# EasyEDA Pro project ProProject_STM32F407IGT6_2024-02-27.epro, board PCB1
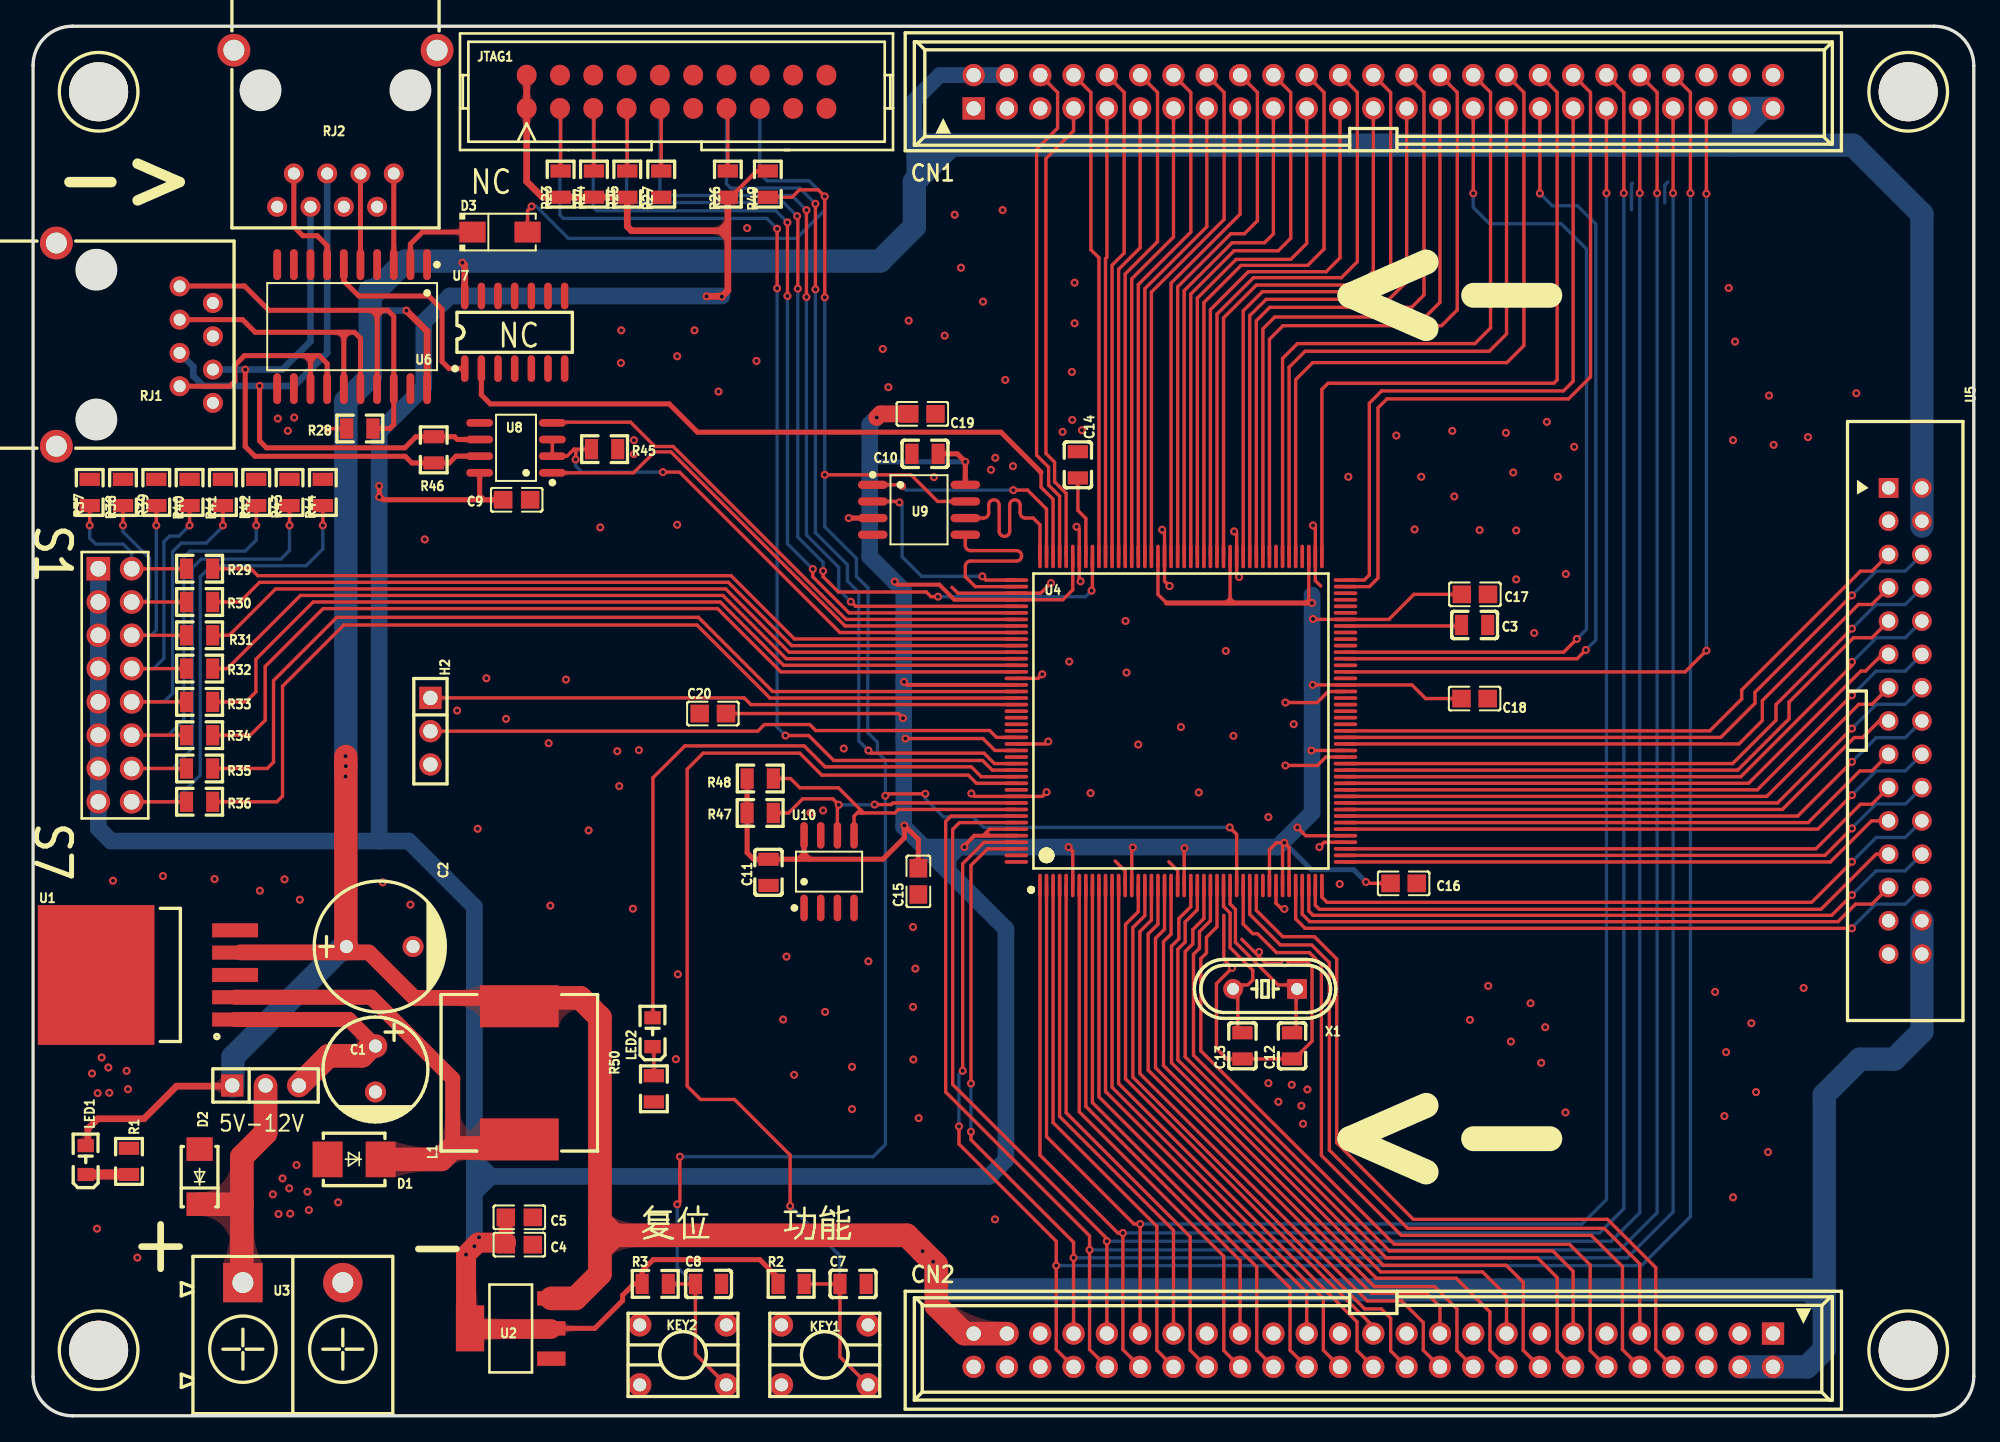
[diagram p10: board, top side]
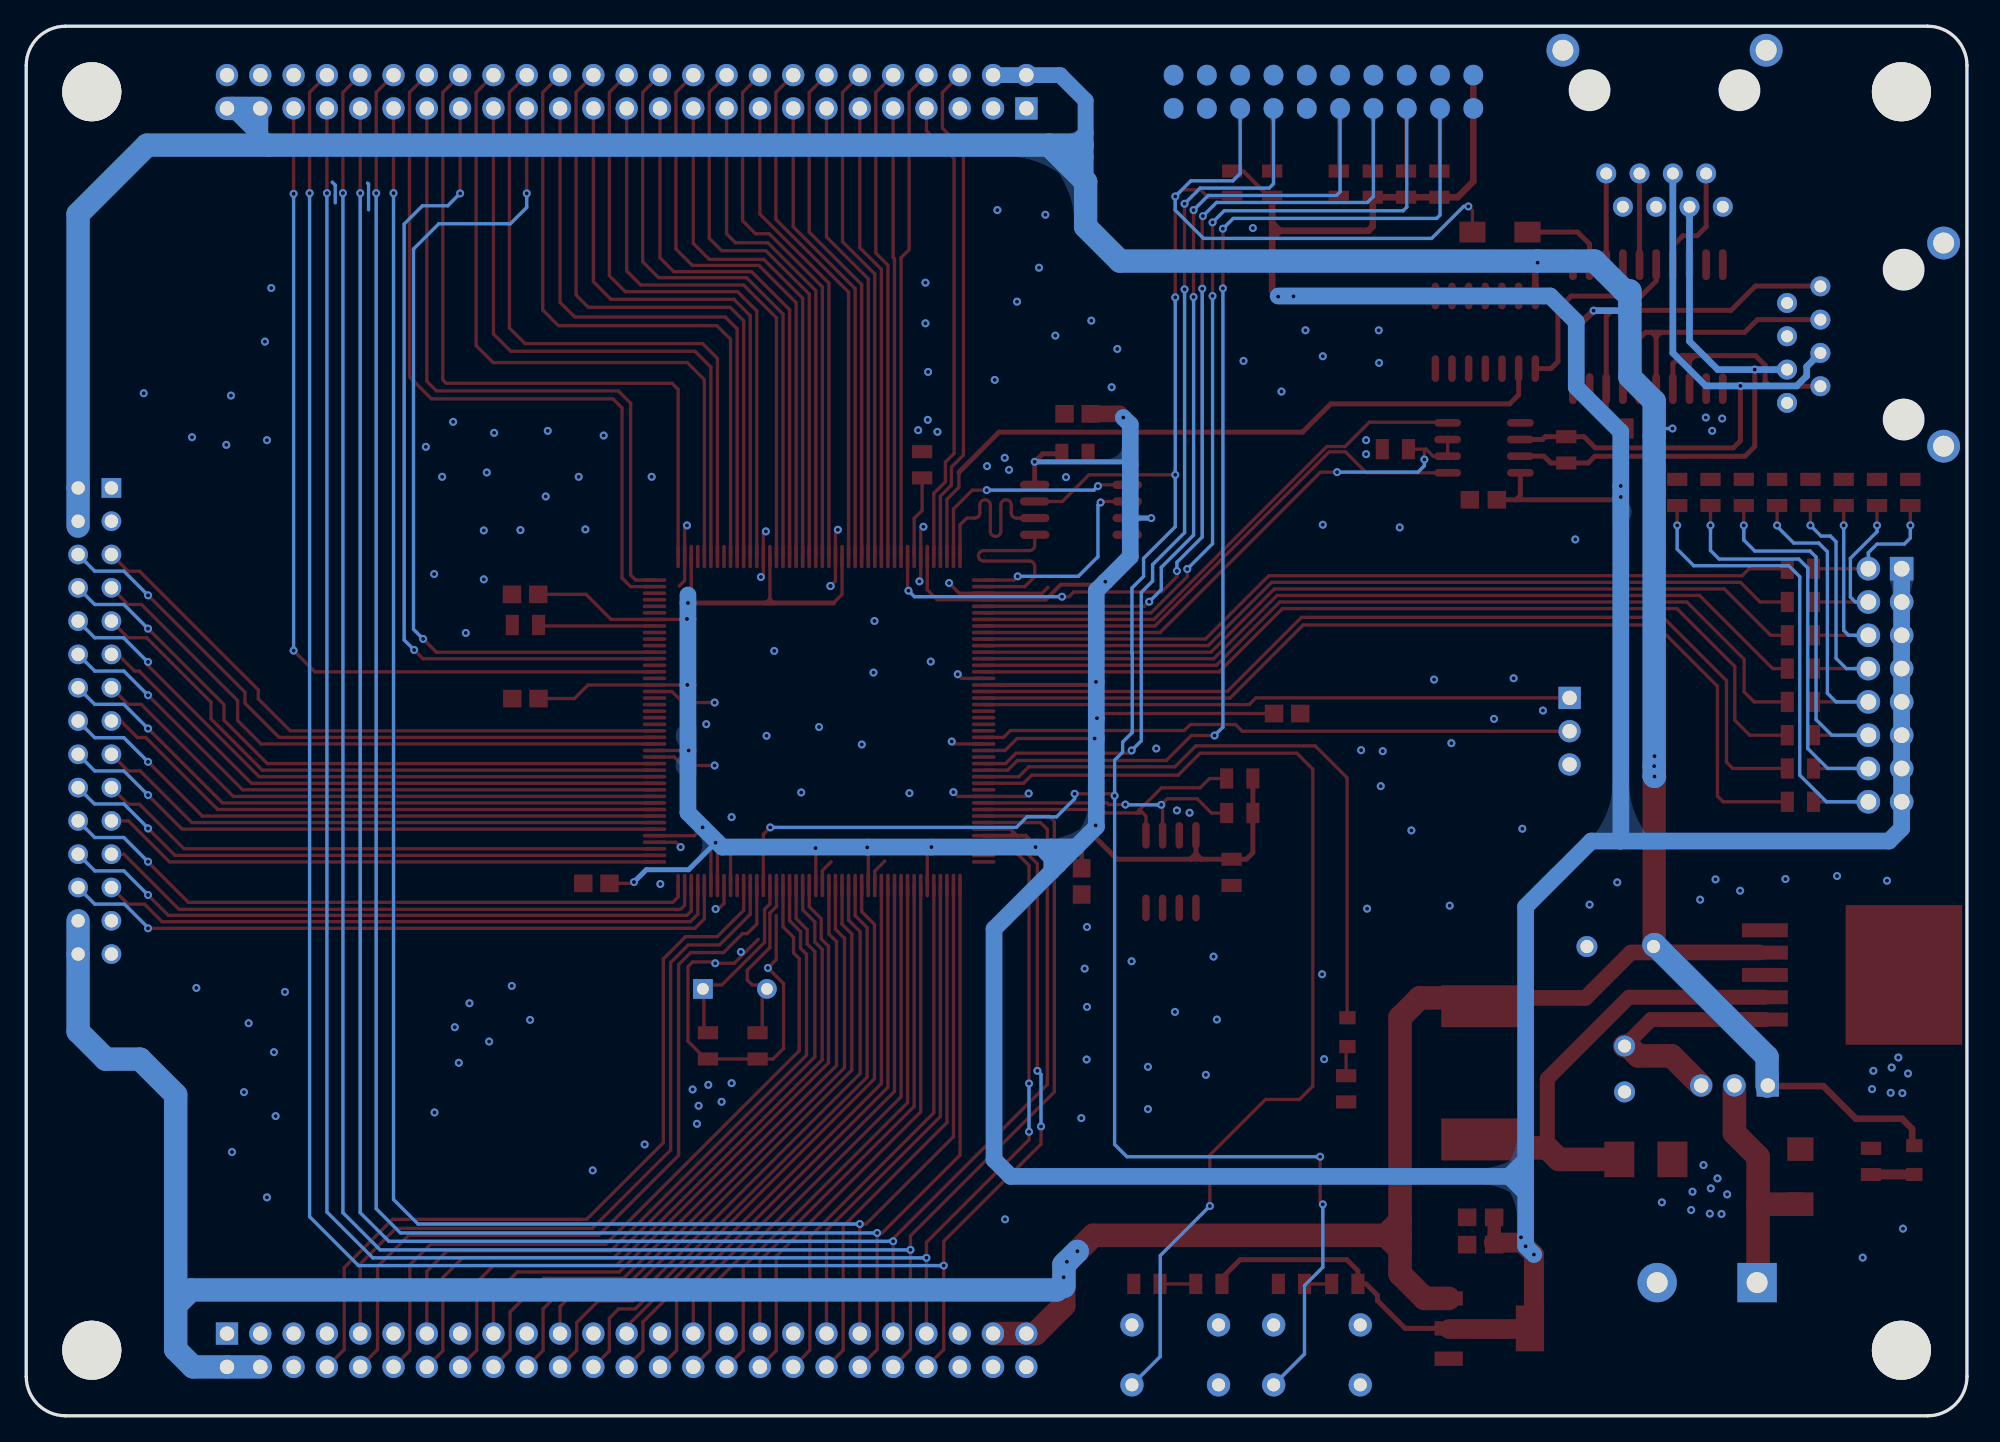
[diagram p11: board, bottom side, seen from below]

Outline 148 x 106 mm; copper layers: Top Layer, Bottom Layer. Coordinates in mm from the lower left corner of the outline.
Outline path: 0,103 0,3 arc(0.88,0.88) 3,0 145,0 arc(147.12,0.88) 148,3 148,103 arc(147.12,105.12) 145,106 3,106 arc(0.88,105.12) 0,103
Stack: Top Layer 0.035mm / Dielectric1 1.51mm FR4 er 4.5 / Bottom Layer 0.035mm

## Design rules (mm)
template: 自定义配置
spacing copperThickness1oz (default): track to track 0.102, other pairs 0.152 to 0.3
spacing copperThickness2oz: track to track 0.203, other pairs 0.152 to 0.3
track width copperThickness1oz (default): min 0.127, default 0.254, max 2.54
track width copperThickness2oz: min 0.203, default 0.254, max 2.54
differential pair differentialPair (default): width min 0.127, default 0.254, max 2.54; gap min 0.152, default 0.152
via viaSize (default): diameter min 0.5, default 0.61, max 10; hole min 0.3, default 0.305, max 6.299
net +12V uses 电源
net +5V uses 电源
net $1N10347 uses 电源
net +3.3V uses 电源

## Placement (name value [footprint] x y rotation side)
5V-12V  -  [HDR-TH_3P-P2.54-V-M]  17.73 25.2 0 top
C1  330uF  [直插电容C1]  26.11 26.42 0 top
C2  1000uF  [直插电容2]  27.64 38 270 top
C3  225  [C0805#2]  109.93 60.32 180 top
C4  106  [C0805#3]  37.08 13.06 180 top
C5  104  [C0805#3]  37.08 15.14 180 top
C7  104  [C0805#2]  62.53 10.06 0 top
C8  104  [C0805#2]  51.51 10.06 0 top
C9  104  [C0805#3]  36.88 69.88 0 top
C10  104  [C0805#2]  68.02 73.38 0 top
C11  104  [C0805#2]  56.08 41.45 90 top
C12  22pF  [C0805#2]  96.01 28.22 90 top
C13  22pF  [C0805#2]  92.23 28.22 90 top
C14  225  [C0805#2]  79.68 72.54 270 top
C15  100nF  [C0805]  67.51 40.77 90 top
C16  100nF  [C0805]  104.52 40.61 180 top
C17  100nF  [C0805]  109.96 62.66 180 top
C18  100nF  [C0805]  109.93 54.71 180 top
C19  100nF  [C0805]  67.82 76.43 180 top
C20  100nF  [C0805]  51.84 53.57 0 top
CN1  BH-00012  [IDC-TH_BH-00012]  102.21 101 0 top
CN2  BH-00012  [IDC-TH_BH-00012]  102.21 5 180 top
D1  SS34-B  [SMB_L4.6-W3.6-LS5.3-RD]  24.49 19.56 180 top
D2  SMAJ25A_C466027  [SMA_L4.4-W2.8-LS5.4-RD]  12.7 18.24 90 top
D3  1N4007  [SMA_L4.3-W2.5-LS5.0-RD]  35.61 90.3 0 top
H1  PZ254V-12-16P  [HDR-TH_16P-P2.54-V-M-R2-C8-S2.54]  6.25 55.73 270 top
H2  -  [HDR-TH_3P-P2.54-V-M]  30.3 52.22 270 top
JTAG1  JTAG  [JTAG_20]  49.07 101 0 top
KEY1  RESET  [按键]  55.42 1.72 0 top
KEY2  RESET  [按键]  44.61 1.72 0 top
L1  100uH  [IND-SMD_L12.0-W12.0_SLH1207S]  37.08 26.16 90 top
LED1  -  [LED0805-RD_RED]  4.01 19.51 90 top
LED2  -  [LED0805-RD_RED]  47.24 29.26 90 top
NOREF  -  [Pad_ie3261]  5 101 180 top
NOREF#2  -  [Pad_ie3266]  143 101 180 top
NOREF#3  -  [Pad_ie3269]  143 5 180 top
NOREF#4  -  [Pad_ie3140]  5 5 180 top
R1  1K  [R0805]  7.32 19.41 90 top
R2  10K  [R0805]  57.81 10.06 0 top
R3  10K  [R0805]  47.45 10.06 0 top
R23  10K  [R0805]  40.23 93.95 270 top
R24  10K  [R0805]  42.77 93.95 270 top
R25  10K  [R0805]  45.31 93.95 270 top
R26  10K  [R0805]  52.98 93.95 270 top
R27  10K  [R0805]  47.9 93.95 270 top
R28  10K  [R0805]  24.92 75.31 0 top
R29  10K  [R0805]  12.7 64.62 0 top
R30  10K  [R0805]  12.7 62.08 0 top
R31  10K  [R0805]  12.7 59.54 0 top
R32  10K  [R0805]  12.7 57 0 top
R33  10K  [R0805]  12.7 54.46 0 top
R34  10K  [R0805]  12.7 51.92 0 top
R35  10K  [R0805]  12.7 49.38 0 top
R36  10K  [R0805]  12.7 46.84 0 top
R37  10K  [R0805]  4.32 70.43 90 top
R38  10K  [R0805]  6.86 70.43 90 top
R39  10K  [R0805]  9.4 70.43 90 top
R40  10K  [R0805]  11.94 70.43 90 top
R41  10K  [R0805]  14.48 70.43 90 top
R42  10K  [R0805]  17.02 70.43 90 top
R43  10K  [R0805]  19.56 70.43 90 top
R44  10K  [R0805]  22.1 70.43 90 top
R45  10K  [R0805]  43.59 73.74 180 top
R46  120  [R0805]  30.56 73.69 270 top
R47  10K  [R0805]  55.45 45.98 180 top
R48  10K  [R0805]  55.46 48.61 180 top
R49  10K  [R0805]  56.03 93.95 270 top
R50  1K  [R0805]  47.35 24.94 270 top
RJ1  R-RJ45R10P-B000  [RJ45-TH_R-RJ45R10P-B000]  7.75 81.71 90 top
RJ2  R-RJ45R10P-B000  [RJ45-TH_R-RJ45R10P-B000]  23.06 98.2 0 top
U1  LM2596S-5.0  [TO-263-5_L10.6-W9.6-P1.70-LS15.9-BR]  10.11 33.63 0 top
U2  AMS1117-3.3_C165482  [SOT-223_L6.5-W3.5-P2.30-LS7.0-BR]  36.42 6.66 0 top
U3  KF7.62-2P  [CONN-TH_2P-P7.62_KEFA_KF7.62-2P]  19.81 10.16 0 top
U4  STM32F407IET6  [LQFP-176_L24.0-W24.0-P0.50-LS26.0-BL]  87.54 53 0 top
U5  ZX-IDC2.54-2-15PZZ  [IDC-TH_30P-P2.54_ZX-IDC2.54-2-15PZZ]  142.77 53 270 top
U6  74HC245D,653  [SOIC-20_L13.0-W7.6-P1.27-LS10.3-BL]  24.33 83.08 180 top
U7  74HC32D  [SOIC-14_L8.6-W3.8-P1.27-LS6.0-BL]  36.73 82.65 0 top
U8  MAX3485EESA+T  [SOIC-8_L4.9-W3.9-P1.27-LS6.0-BL]  36.83 73.84 90 top
U9  W25Q16JVSSIQ  [SOIC-8_L5.3-W5.3-P1.27-LS8.0-BL]  67.56 69.11 270 top
U10  AT24C02  [SOP-8_L5.0-W4.0-P1.27-LS6.0-BL]  60.7 41.51 0 top
X1  -  [HC-49US_L11.5-W4.5-P4.88]  93.95 32.56 180 top

## Footprints (pads in the part's own frame, mm; a bottom-side part is the same pattern mirrored in y, then rotated)
C0805
  rect 1.41x1.35 smd: 1(-1,0) 2(1,0)
C0805#2
  rect 1x1.55 smd: 1(-1,0) 2(1,0)
C0805#3
  rect 1.41x1.35 smd: 1(-1.03,0) 2(1.03,0)
CONN-TH_2P-P7.62_KEFA_KF7.62-2P
  rect 3x3 hole 1.6: 1(-3.81,0)
  round 3 hole 1.6: 2(3.81,0)
HC-49US_L11.5-W4.5-P4.88
  rect 1.501x1.501 hole 0.899: 1(-2.441,0)
  round 1.501 hole 0.899: 2(2.441,0)
HDR-TH_3P-P2.54-V-M
  rect 1.7x1.7 hole 1.1: 1(-2.54,0)
  round 1.7 hole 1.1: 2(0,0) 3(2.54,0)
HDR-TH_16P-P2.54-V-M-R2-C8-S2.54
  rect 1.8x1.8 hole 1.2: 1(-8.89,-1.27)
  round 1.8 hole 1.2: 2(-8.89,1.27) 3(-6.35,-1.27) 4(-6.35,1.27) 5(-3.81,-1.27) 6(-3.81,1.27) 7(-1.27,-1.27) 8(-1.27,1.27) 9(1.27,-1.27) 10(1.27,1.27) 11(3.81,-1.27) 12(3.81,1.27) 13(6.35,-1.27) 14(6.35,1.27) 15(8.89,-1.27) 16(8.89,1.27)
IDC-TH_30P-P2.54_ZX-IDC2.54-2-15PZZ
  rect 1.5x1.5 hole 1.02: 1(-17.78,-1.27)
  round 1.5 hole 1.02: 2(-17.78,1.27) 3(-15.24,-1.27) 4(-15.24,1.27) 5(-12.7,-1.27) 6(-12.7,1.27) 7(-10.16,-1.27) 8(-10.16,1.27) 9(-7.62,-1.27) 10(-7.62,1.27) 11(-5.08,-1.27) 12(-5.08,1.27) 13(-2.54,-1.27) 14(-2.54,1.27) 15(0,-1.27) 16(0,1.27) 17(2.54,-1.27) 18(2.54,1.27) 19(5.08,-1.27) 20(5.08,1.27) 21(7.62,-1.27) 22(7.62,1.27) 23(10.16,-1.27) 24(10.16,1.27) 25(12.7,-1.27) 26(12.7,1.27) 27(15.24,-1.27) 28(15.24,1.27) 29(17.78,-1.27) 30(17.78,1.27)
IDC-TH_BH-00012
  rect 1.7x1.7 hole 1.1: 1(-30.48,-1.27)
  round 1.7 hole 1.1: 2(-30.48,1.27) 3(-27.94,-1.27) 4(-27.94,1.27) 5(-25.4,-1.27) 6(-25.4,1.27) 7(-22.86,-1.27) 8(-22.86,1.27) 9(-20.32,-1.27) 10(-20.32,1.27) 11(-17.78,-1.27) 12(-17.78,1.27) 13(-15.24,-1.27) 14(-15.24,1.27) 15(-12.7,-1.27) 16(-12.7,1.27) 17(-10.16,-1.27) 18(-10.16,1.27) 19(-7.62,-1.27) 20(-7.62,1.27) 21(-5.08,-1.27) 22(-5.08,1.27) 23(-2.54,-1.27) 24(-2.54,1.27) 25(0,-1.27) 26(0,1.27) 27(2.54,-1.27) 28(2.54,1.27) 29(5.08,-1.27) 30(5.08,1.27) 31(7.62,-1.27) 32(7.62,1.27) 33(10.16,-1.27) 34(10.16,1.27) 35(12.7,-1.27) 36(12.7,1.27) 37(15.24,-1.27) 38(15.24,1.27) 39(17.78,-1.27) 40(17.78,1.27) 41(20.32,-1.27) 42(20.32,1.27) 43(22.86,-1.27) 44(22.86,1.27) 45(25.4,-1.27) 46(25.4,1.27) 47(27.94,-1.27) 48(27.94,1.27) 49(30.48,-1.27) 50(30.48,1.27)
IND-SMD_L12.0-W12.0_SLH1207S
  rect 3.2x6 smd: 1(-5.08,0) 2(5.08,0)
JTAG_20
  custom 1.499x1.573 hole 0.905x0.9: 1(-11.43,-1.27) 2(-11.43,1.27) 11(1.27,-1.27) 17(8.89,-1.27) 19(11.43,-1.27)
  custom 1.499x1.573 hole 0.9x0.905: 3(-8.89,-1.27) 4(-8.89,1.27) 5(-6.35,-1.27) 6(-6.35,1.27) 7(-3.81,-1.27) 8(-3.81,1.27) 9(-1.27,-1.27) 10(-1.27,1.27) 12(1.27,1.27) 13(3.81,-1.27) 14(3.81,1.27) 15(6.35,-1.27) 16(6.35,1.27) 18(8.89,1.27) 20(11.43,1.27)
LED0805-RD_RED
  rect 1x1.25 smd: 1(-1.1,0) 2(1.1,0)
LQFP-176_L24.0-W24.0-P0.50-LS26.0-BL
  oval 0.28x1.8 smd: 1(-10.75,-12.55) 2(-10.25,-12.55) 3(-9.75,-12.55) 4(-9.25,-12.55) 5(-8.75,-12.55) 6(-8.25,-12.55) 7(-7.75,-12.55) 8(-7.25,-12.55) 9(-6.75,-12.55) 10(-6.25,-12.55) 11(-5.75,-12.55) 12(-5.25,-12.55) 13(-4.75,-12.55) 14(-4.25,-12.55) 15(-3.75,-12.55) 16(-3.25,-12.55) 17(-2.75,-12.55) 18(-2.25,-12.55) 19(-1.75,-12.55) 20(-1.25,-12.55) 21(-0.75,-12.55) 22(-0.25,-12.55) 23(0.25,-12.55) 24(0.75,-12.55) 25(1.25,-12.55) 26(1.75,-12.55) 27(2.25,-12.55) 28(2.75,-12.55) 29(3.25,-12.55) 30(3.75,-12.55) 31(4.25,-12.55) 32(4.75,-12.55) 33(5.25,-12.55) 34(5.75,-12.55) 35(6.25,-12.55) 36(6.75,-12.55) 37(7.25,-12.55) 38(7.75,-12.55) 39(8.25,-12.55) 40(8.75,-12.55) 41(9.25,-12.55) 42(9.75,-12.55) 43(10.25,-12.55) 44(10.75,-12.55) 89(10.75,12.55) 90(10.25,12.55) 91(9.75,12.55) 92(9.25,12.55) 93(8.75,12.55) 94(8.25,12.55) 95(7.75,12.55) 96(7.25,12.55) 97(6.75,12.55) 98(6.25,12.55) 99(5.75,12.55) 100(5.25,12.55) 101(4.75,12.55) 102(4.25,12.55) 103(3.75,12.55) 104(3.25,12.55) 105(2.75,12.55) 106(2.25,12.55) 107(1.75,12.55) 108(1.25,12.55) 109(0.75,12.55) 110(0.25,12.55) 111(-0.25,12.55) 112(-0.75,12.55) 113(-1.25,12.55) 114(-1.75,12.55) 115(-2.25,12.55) 116(-2.75,12.55) 117(-3.25,12.55) 118(-3.75,12.55) 119(-4.25,12.55) 120(-4.75,12.55) 121(-5.25,12.55) 122(-5.75,12.55) 123(-6.25,12.55) 124(-6.75,12.55) 125(-7.25,12.55) 126(-7.75,12.55) 127(-8.25,12.55) 128(-8.75,12.55) 129(-9.25,12.55) 130(-9.75,12.55) 131(-10.25,12.55) 132(-10.75,12.55)
  oval 1.8x0.28 smd: 45(12.55,-10.75) 46(12.55,-10.25) 47(12.55,-9.75) 48(12.55,-9.25) 49(12.55,-8.75) 50(12.55,-8.25) 51(12.55,-7.75) 52(12.55,-7.25) 53(12.55,-6.75) 54(12.55,-6.25) 55(12.55,-5.75) 56(12.55,-5.25) 57(12.55,-4.75) 58(12.55,-4.25) 59(12.55,-3.75) 60(12.55,-3.25) 61(12.55,-2.75) 62(12.55,-2.25) 63(12.55,-1.75) 64(12.55,-1.25) 65(12.55,-0.75) 66(12.55,-0.25) 67(12.55,0.25) 68(12.55,0.75) 69(12.55,1.25) 70(12.55,1.75) 71(12.55,2.25) 72(12.55,2.75) 73(12.55,3.25) 74(12.55,3.75) 75(12.55,4.25) 76(12.55,4.75) 77(12.55,5.25) 78(12.55,5.75) 79(12.55,6.25) 80(12.55,6.75) 81(12.55,7.25) 82(12.55,7.75) 83(12.55,8.25) 84(12.55,8.75) 85(12.55,9.25) 86(12.55,9.75) 87(12.55,10.25) 88(12.55,10.75) 133(-12.55,10.75) 134(-12.55,10.25) 135(-12.55,9.75) 136(-12.55,9.25) 137(-12.55,8.75) 138(-12.55,8.25) 139(-12.55,7.75) 140(-12.55,7.25) 141(-12.55,6.75) 142(-12.55,6.25) 143(-12.55,5.75) 144(-12.55,5.25) 145(-12.55,4.75) 146(-12.55,4.25) 147(-12.55,3.75) 148(-12.55,3.25) 149(-12.55,2.75) 150(-12.55,2.25) 151(-12.55,1.75) 152(-12.55,1.25) 153(-12.55,0.75) 154(-12.55,0.25) 155(-12.55,-0.25) 156(-12.55,-0.75) 157(-12.55,-1.25) 158(-12.55,-1.75) 159(-12.55,-2.25) 160(-12.55,-2.75) 161(-12.55,-3.25) 162(-12.55,-3.75) 163(-12.55,-4.25) 164(-12.55,-4.75) 165(-12.55,-5.25) 166(-12.55,-5.75) 167(-12.55,-6.25) 168(-12.55,-6.75) 169(-12.55,-7.25) 170(-12.55,-7.75) 171(-12.55,-8.25) 172(-12.55,-8.75) 173(-12.55,-9.25) 174(-12.55,-9.75) 175(-12.55,-10.25) 176(-12.55,-10.75)
Pad_ie3140
  round 4.5 hole 4.5: 4(0,0)
Pad_ie3261
  round 4.5 hole 4.5: 4(0,0)
Pad_ie3266
  round 4.5 hole 4.5: 4(0,0)
Pad_ie3269
  round 4.5 hole 4.5: 4(0,0)
R0805
  rect 1x1.55 smd: 1(-1,0) 2(1,0)
RJ45-TH_R-RJ45R10P-B000
  round 1.524 hole 0.914: 1(4.445,-3.43) 2(3.175,-5.97) 3(1.905,-3.43) 4(0.635,-5.97) 5(-0.635,-3.43) 6(-1.905,-5.97) 7(-3.175,-3.43) 8(-4.445,-5.97)
  round 2.5 hole 1.6: 9(7.75,5.97) 10(-7.75,5.97)
SMA_L4.3-W2.5-LS5.0-RD
  rect 2x1.593 smd: 1(-2.1,0) 2(2.1,0)
SMA_L4.4-W2.8-LS5.4-RD
  rect 1.8x2 smd: 1(-2.1,0) 2(2.1,0)
SMB_L4.6-W3.6-LS5.3-RD
  rect 2.29x2.72 smd: 1(-2.025,0) 2(2.025,0)
SOIC-8_L4.9-W3.9-P1.27-LS6.0-BL
  oval 0.588x2.045 smd: 1(-1.905,-2.772) 2(-0.635,-2.772) 3(0.635,-2.772) 4(1.905,-2.772) 5(1.905,2.772) 6(0.635,2.772) 7(-0.635,2.772) 8(-1.905,2.772)
SOIC-8_L5.3-W5.3-P1.27-LS8.0-BL
  oval 0.63x2.25 smd: 1(-1.905,-3.53) 2(-0.635,-3.53) 3(0.635,-3.53) 4(1.905,-3.53) 5(1.905,3.53) 6(0.635,3.53) 7(-0.635,3.53) 8(-1.905,3.53)
SOIC-14_L8.6-W3.8-P1.27-LS6.0-BL
  oval 0.574x2.038 smd: 1(-3.81,-2.769) 2(-2.54,-2.769) 3(-1.27,-2.769) 4(0,-2.769) 5(1.27,-2.769) 6(2.54,-2.769) 7(3.81,-2.769) 8(3.81,2.769) 9(2.54,2.769) 10(1.27,2.769) 11(0,2.769) 12(-1.27,2.769) 13(-2.54,2.769) 14(-3.81,2.769)
SOIC-20_L13.0-W7.6-P1.27-LS10.3-BL
  oval 0.595x2.36 smd: 1(-5.715,-4.73) 2(-4.445,-4.73) 3(-3.175,-4.73) 4(-1.905,-4.73) 5(-0.635,-4.73) 6(0.635,-4.73) 7(1.905,-4.73) 8(3.175,-4.73) 9(4.445,-4.73) 10(5.715,-4.73) 11(5.715,4.73) 12(4.445,4.73) 13(3.175,4.73) 14(1.905,4.73) 15(0.635,4.73) 16(-0.635,4.73) 17(-1.905,4.73) 18(-3.175,4.73) 19(-4.445,4.73) 20(-5.715,4.73)
SOP-8_L5.0-W4.0-P1.27-LS6.0-BL
  oval 0.574x2.035 smd: 1(-1.905,-2.768) 2(-0.635,-2.768) 3(0.635,-2.768) 4(1.905,-2.768) 5(1.905,2.768) 6(0.635,2.768) 7(-0.635,2.768) 8(-1.905,2.768)
SOT-223_L6.5-W3.5-P2.30-LS7.0-BR
  rect 2.159x1.092 smd: 1(3.099,-2.299) 2(3.099,0.013) 3(3.099,2.299)
  rect 2.159x3.505 smd: 4(-3.099,0.013)
TO-263-5_L10.6-W9.6-P1.70-LS15.9-BR
  rect 3.5x1.069 smd: 1(5.3,-3.404) 2(5.3,-1.702) 3(5.3,0) 4(5.3,1.702) 5(5.3,3.404)
  rect 8.89x10.66 smd: 6(-5.3,0)
按键
  round 1.778 hole 1: 1(8.255,0.635) 2(8.255,5.207) 3(1.651,5.207) 4(1.651,0.635)
直插电容2
  round 1.6 hole 1: 1(2.206,-3.735) 2(2.206,1.345)
直插电容C1
  round 1.6 hole 1: 1(-0.001,1.788) 2(-0.001,-1.712)

## Nets
As in the schematic.

Pads without a net: JTAG1 11 17 19; KEY1 3 4; KEY2 3 4; NOREF 4; NOREF#2 4; NOREF#3 4; NOREF#4 4; RJ1 9 10; RJ2 9 10; U7 6 8 11

## Via types
v1: diameter 0.61, hole 0.305, Top Layer to Bottom Layer, 281 vias

## Routing (per net, layer and track width the routed paths; a pad name or vN(x,y) marks a point on that pad's centre or on a via; arc(x,y) is an arc through that point)
+3.3V: length 573.8
  Top Layer w0.254: U4.38 95.29,43.57 v1(95.43,43.71) ; 36.05,13.21 C4.2 ; 72.7,44.5 72.44,44.25 ; 72.7,44.5 72.94,44.75 74.99,44.75 ; 72.7,44.5 72.95,44.25 ; v1(97.59,55.75) 97.59,55.75 105.16,55.75 106.2,54.71 C18.2 ; 97.29,62.25 97.04,62 ; 97.29,62.25 v1(97.54,62) ; 97.29,62.25 U4.91 ; 100.09,50.75 v1(97.49,50.75) ; 91.27,62 91.29,62.02 91.29,62.33 ; v1(96.42,44.88) 97.05,44.25 100.09,44.25 ; v1(78.97,43.38) 79.29,43.07 U4.6 ; v1(101.65,40.72) 101.75,40.61 C16.2 ; v1(87.81,43.31) 87.79,43.29 87.79,40.45 ; C20.2 65.99,53.57 v1(66.34,53.21) ; v1(83.87,43.36) 83.79,43.27 83.79,40.45 ; 91.29,62.33 90.96,62 ; 91.29,62.33 U4.103 ; 91.29,62.33 91.61,62 ; v1(97.61,60.78) 97.64,60.75 103.4,60.75 105.31,62.66 C17.2 ; 74.99,62.25 78.53,62.25 79.29,63 U4.127 ; U4.36 94.29,43.18 94.82,43.71 v1(95.43,43.71) ; v1(95.43,43.71) 95.79,43.35 95.79,40.45 ; 86.44,62 85.79,62.65 85.79,65.55 ; v1(66.52,51.66) 72.44,51.66 73.35,50.75 74.99,50.75
  Top Layer w0.305: 74.99,62.25 70.26,62.25 69.11,63.4 65.94,63.4 v1(65.71,63.63) ; 52.98,92.75 55.19,94.95 R49.1 ; v1(66.42,55.98) 66.65,55.75 74.99,55.75 ; 74.99,44.25 71.78,44.25 71.03,43.49 v1(71.03,43.38)
  Top Layer w0.381: 58.8,42.87 59.22,42.45 ; 58.8,42.87 58.8,44.28 ; 58.8,42.87 58.38,42.45 ; 59.22,42.45 58.38,42.45 ; 59.22,42.45 64.81,42.45 66.45,44.09 v1(66.45,45.03) 67.51,43.97 C15.2 ; U9.8 v1(71.09,72.77) 70.49,73.38 C10.2 ; R2.1 56.81,10.53 55.42,11.91 47.3,11.91 46.45,11.06 R3.1 45.82,10.06 44.96,9.19 44.96,8.79 42.84,6.67 U2.2 ; v1(97.54,62) 86.44,62 ; 34.39,69.88 C9.1 ; 34.39,69.88 34.06,70.21 U8.8 ; 34.39,69.88 26.72,69.88 ; U9.3 v1(62.2,68.48) ; 58.38,42.45 C11.2 54.96,42.45 54.46,42.95 R48.2 ; 26.52,70.08 26.71,69.89 26.4,70.17 v1(26.4,70.93)
  Top Layer w0.508: 52.4,90.4 52.98,89.81 ; 52.4,90.4 52.98,90.98 ; 52.4,90.4 45.64,90.4 45.31,90.73 R25.2 R24.2 R23.2 38.85,92.95 37.64,94.16 JTAG1.1 JTAG1.2 ; 52.98,89.81 52.98,90.98 ; 52.98,89.81 52.98,85.83 52.55,85.39 ; 52.98,90.98 R26.2 ; 52.55,85.39 v1(52.53,85.37) ; 52.55,85.39 v1(51.36,85.39)
  Top Layer w1.016: 36.05,13.21 C5.2
  Top Layer w1.27: C19.2 64.62,76.43 v1(64.34,76.15)
  Top Layer w1.499: 39.5,6.62 33.07,6.62 33.06,6.6
  Top Layer w1.524: 33.06,6.6 33.02,6.64 v1(33.02,12.3) v1(33.66,12.93) 33.93,13.21 36.07,13.21
  Bottom Layer w0.254: 83.86,43.38 83.87,43.38 v1(83.87,43.36) ; 66.4,55.99 66.41,55.99 v1(66.42,55.98) ; v1(95.43,43.71) 95.34,43.8 95.34,43.8 ; v1(66.34,53.21) 66.36,53.2 66.4,53.2 ; 97.54,60.77 97.55,60.78 v1(97.61,60.78) ; v1(66.52,51.66) 66.41,51.66 66.4,51.68 ; v1(87.81,43.31) 87.81,43.38 ; v1(97.49,50.75) 97.54,50.75 ; 64.06,72.77 63.81,72.52 ; v1(97.59,55.75) 97.54,55.75 97.54,55.75 ; v1(101.65,40.72) 101.65,40.74 ; 63.81,68.48 U9.3
  Bottom Layer w0.381: 26.52,70.08 26.51,70.09 v1(26.4,70.09) ; v1(101.65,40.72) 100.71,41.66 97.49,41.66 v1(95.43,43.71) ; v1(62.2,68.48) 63.81,68.48 ; v1(66.45,45.03) 66.4,44.98 ; v1(71.09,72.77) 64.06,72.77
  Bottom Layer w0.508: v1(52.53,85.37) 52.53,85.42 52.53,85.42
  Bottom Layer w1.27: 52.53,85.42 31.78,85.42 29.79,83.44 29.79,78.46 26.4,75.06 v1(26.4,70.93) v1(26.4,70.09) 26.4,43.84 ; 26.4,43.84 28.65,43.84 33.66,38.84 33.66,19.52 ; 26.4,43.84 5.94,43.84 4.98,44.81 H1.15 H1.13 H1.11 H1.9 H1.7 H1.5 H1.3 H1.1 ; 67.94,43.38 66.4,44.93 66.4,62.94 v1(65.71,63.63) 63.81,65.53 63.81,75.62 v1(64.34,76.15) ; 67.94,43.38 69.26,42.06 ; 67.94,43.38 69.84,43.38 ; 69.26,42.06 69.26,42.8 69.84,43.38 ; 69.26,42.06 69.78,41.54 ; 69.78,41.54 69.78,42.56 70.31,43.08 ; 69.78,41.54 74.19,37.13 74.19,19.53 72.92,18.26 34.92,18.26 ; 69.84,43.38 v1(71.03,43.38) v1(78.97,43.38) 94.92,43.38 95.34,43.8 v1(96.42,44.88) 97.54,46 v1(97.54,62) 97.54,62.61 ; 33.66,17 v1(33.66,12.93) v1(33.02,12.3) ; 33.66,17 34.92,18.26 ; 33.66,17 33.66,18.24 ; 34.92,18.26 33.68,18.26 33.66,18.24 ; 34.92,18.26 33.66,19.52 ; 33.66,18.24 33.66,19.52
  vias: v1(34.01,13.61)
+5V: length 486.9
  Top Layer w0.254: R28.1 v1(22.45,75.31)
  Top Layer w0.508: v1(32.74,87.96) 32.92,87.78 32.92,85.42 ; 4.18,20.75 4.18,21.89 4.95,22.66 8.46,22.66 10.95,25.15 15.44,25.15 ; U6.20 30.05,82.73 v1(28.47,84.3)
  Top Layer w1.2: 23.88,35.35 23.28,35.35 ; 23.88,35.35 25.61,35.35 ; 23.88,35.35 23.88,35.94 23.28,35.35 ; 23.28,35.35 15.81,35.35 ; 37.72,31.88 29.08,31.88 25.65,35.31
  Top Layer w1.778: 23.85,50.29 v1(23.85,49.56) 23.85,35.97 23.88,35.94
  Top Layer w1.8: U2.3 41.36,8.95 43.23,10.82 43.23,12.67 ; 44.32,13.77 66.62,13.77 v1(67.84,12.55) v1(68.64,11.75) 68.88,11.51 v1(68.88,10.57) 68.88,8.41 71.02,6.27 CN2.47 ; 44.32,13.77 43.23,12.67 ; 44.32,13.77 43.23,14.86 ; 44.32,13.77 43.25,13.77 43.23,13.79 ; 37.72,31.88 41.73,31.88 43.23,30.38 43.23,14.86 ; 43.23,12.67 43.23,13.79 ; 43.23,13.79 43.23,14.86
  Bottom Layer w0.254: 23.17,75.31 23.57,75.72 ; 23.17,75.31 23.32,75.31 ; 23.17,75.31 23.69,74.78 23.85,74.78 23.32,75.31 ; 23.17,75.31 v1(22.45,75.31) ; 23.32,75.31 23.81,75.31 ; v1(32.74,87.96) 32.74,88.08 32.75,88.09
  Bottom Layer w0.508: 25.7,84.78 26.18,84.3 v1(28.47,84.3)
  Bottom Layer w1.2: 129.46,96.93 130.15,97.61 ; 130.15,97.61 CN1.47 ; 130.15,97.61 132.27,99.73 ; 67.21,96.01 67.21,97.84 ; 67.21,96.01 68.12,96.93 67.21,97.84 ; 67.21,96.01 67.21,94.13 ; 67.21,97.84 67.21,100.33 69.15,102.27 CN1.2 CN1.4
  Bottom Layer w1.778: 26.24,85.93 28.4,88.09 64.59,88.09 67.21,90.7 67.21,94.13 70.01,96.93 ; 26.24,85.93 25.7,85.39 ; 26.24,85.93 25.7,85.8 25.7,85.39 ; v1(23.83,48.77) 23.85,48.79 v1(23.85,49.56) 23.85,77.39 25.7,79.25 25.7,85.39 ; 144.04,67.86 U5.2 144.04,91.67 138.79,96.93 70.01,96.93 ; 68.91,10.11 69.42,9.6 135.43,9.6 136.6,8.43 ; 70.01,96.93 67.49,96.93 67.46,96.9 ; 136.6,8.43 136.6,5.05 135.28,3.73 CN2.2 CN2.4 ; 136.6,8.43 136.6,24.49 139.32,27.2 141.94,27.2 144.04,29.31 U5.30 U5.28 ; 67.84,12.55 v1(68.64,11.75) 68.86,11.53 68.86,9.85 ; 23.88,35.94 23.81,35.94 15.24,27.37 15.24,25.15 ; CN1.47 CN1.49
  vias: v1(23.83,50.32)
+12V: length 18.6
  Top Layer w1.143: C1.1 24.09,30.23 U1.1
  Top Layer w1.8: C1.1 25.82,28.2 25.08,27.46 22.53,27.46 5V-12V.3
GND: length 89.2
  Top Layer w0.254: 100.09,43.75 98.46,43.75 v1(98.09,43.38) ; v1(95.5,49.61) 97.94,49.61 98.59,50.25 100.09,50.25 ; 74.99,51.25 77.23,51.25 v1(77.42,51.43) ; v1(91.97,63.98) 91.79,64.17 91.79,67.27 v1(91.59,67.46) ; 90.81,38.18 90.81,34.8 v1(91.44,34.16) 90.25,32.97 90.25,28.02 91.04,27.22 C13.1 C12.1 96.18,27.22 97.54,28.57 97.54,34.26 97.18,34.62 95.56,34.62 v1(95.45,34.52) 94.01,34.52 92.18,36.35 ; v1(86.66,63.3) 86.29,63.68 U4.113 86.29,67.41 v1(86.11,67.59) ; v1(79.58,67.82) 79.79,67.61 U4.126 79.79,63.75 v1(79.88,63.65) ; 98.2,63.3 97.79,63.71 97.79,67.75 v1(97.61,67.92) ; 70.08,63.19 70.52,62.75 76.85,62.75 v1(77.62,63.53) ; 86.61,42.27 87.29,41.59 U4.22 ; v1(76.96,56.57) 76.65,56.25 74.99,56.25 ; v1(71.55,47.47) 71.77,47.25 76.97,47.25 v1(77.29,47.57) ; 100.09,55.25 98.76,55.25 97.92,54.41 v1(95.5,54.41) ; U4.14 83.29,41.55 82.52,42.32 ; v1(95.43,38.66) 95.22,38.66 94.79,39.1 94.79,40.45
  Bottom Layer w0.254: 121.97,94.03 121.89,93.95 121.89,92 ; 124.43,92.53 124.43,93.88 124.66,94.11
  vias: v1(4.5,26.11) v1(4.88,14.28) v1(4.93,24.61) v1(5.23,27.33) v1(5.74,26.57) v1(5.82,24.64) v1(6.1,40.82) v1(7.14,26.31) v1(7.24,24.92) v1(7.95,12.06) v1(9.91,41.17) v1(13.84,40.94) v1(17.3,40.06) v1(18.29,16.89) v1(18.67,76.07) v1(18.72,15.39) v1(19.02,18.11) v1(19.18,40.92) v1(19.43,75.13) v1(19.53,17.35) v1(19.61,15.42) v1(19.91,76.15) v1(20.09,19.13) v1(20.35,39.37) v1(20.93,17.09) v1(21.03,15.7) v1(23.27,16.28) v1(26.67,40.69) v1(28.78,38.99) v1(29.87,66.85) v1(32.33,53.8) v1(33.91,44.78) v1(34.57,56.26) v1(36.07,53.16) v1(39.32,51.31) v1(39.45,38.91) v1(40.64,56.16) v1(42.37,44.65) v1(43.26,67.77) v1(44.55,50.7) v1(44.7,48.03) v1(44.86,82.8) v1(44.83,80.31) v1(45.75,38.68) v1(45.82,74.42) v1(45.82,73.35) v1(46.2,50.77) v1(49.02,27.2) v1(49.12,80.82) v1(49.12,67.97) v1(49.17,33.68) v1(50.44,82.8) v1(52.27,78.13) v1(54.46,90.6) v1(55.17,80.47) v1(57.2,30.23) v1(57.46,35.03) v1(58.04,26.01) v1(59.28,46) v1(60.25,46.18) v1(60.4,30.81) v1(61.82,50.9) v1(62.46,26.62) v1(62.46,23.39) v1(63.7,34.67) v1(64.8,81.38) v1(65.23,78.46) v1(66.78,83.54) v1(67.11,37.29) v1(67.11,31.19) v1(67.13,27.18) v1(67.28,34.11) v1(67.54,22.71) v1(68.71,71.6) v1(69.52,82.4) v1(70.28,91.62) v1(70.76,87.58) v1(72.44,84.99) v1(73.05,72.16) v1(73.38,73.08) v1(73.36,14.99) v1(73.94,91.97) v1(74.14,79.02) v1(74.73,72.44) v1(78.51,75.06) v1(79.02,57.53) v1(79.22,79.63) v1(79.25,75.97) v1(79.43,86.44) v1(79.43,83.34) v1(79.98,75.18) v1(80.65,47.5) v1(83.31,60.63) v1(83.39,56.69) v1(84.28,51.21) v1(87.54,52.54) v1(88.9,47.55) v1(90.96,58.34) v1(91.54,51.87) v1(93.5,35.38) v1(94.21,45.67) v1(94.21,25.37) v1(94.97,23.95) v1(95.99,25.25) v1(96.14,52.76) v1(96.72,23.65) v1(96.85,22.28) v1(97.18,24.89) v1(99.64,40.56) v1(100.3,71.63) v1(100.84,20.7) v1(103.96,74.78) v1(104.8,18.72) v1(105.36,67.61) v1(105.87,71.63) v1(108.23,75.13) v1(108.38,70.13) v1(109.58,30.2) v1(110.31,67.56) v1(110.97,32.79) v1(112.32,74.98) v1(112.7,28.55) v1(112.88,71.96) v1(113.11,67.54) v1(113.11,63.8) v1(114.2,31.47) v1(114.48,59.72) v1(115.01,26.92) v1(115.32,29.64) v1(115.44,75.82) v1(116.28,71.63) v1(116.89,64.21) v1(116.87,23.14) v1(117.53,73.91) v1(128.27,32.33) v1(128.98,22.86) v1(129.11,27.74) v1(129.31,86.03) v1(129.64,74.42) v1(129.64,16.66) v1(129.79,81.94) v1(131.04,29.95) v1(131.39,24.69) v1(132.38,77.83) v1(132.31,20.12) v1(132.74,74.07) v1(135.03,32.64) v1(135.36,74.65) v1(139.04,78)
485A_SLAVE: length 49.1
  Top Layer w0.381: v1(17.28,78.56) 17.28,74.37 17.81,73.84 28.35,73.84 29.19,74.69 R46.1 32.15,74.69 32.36,74.47 U8.6
  Bottom Layer w0.508: 11.18,81.08 12.22,80.04 12.22,79.32 12.98,78.56 v1(17.28,78.56) 19.91,78.56 22.43,81.08 RJ2.5
485B_SLAVE: length 43.1
  Top Layer w0.381: v1(16.18,79.81) 16.18,73.94 16.93,73.19 28.38,73.19 28.89,72.69 R46.2 31.74,72.69 32.26,73.2 U8.7
  Bottom Layer w0.508: RJ1.6 v1(16.18,79.81) 19,79.81 21.16,81.97 RJ2.6
485SLAVE: length 44.7
  Top Layer w0.254: v1(41.38,72.95) 41.38,73.61 41.25,73.74 ; 74.99,59.75 61.53,59.75 49.3,71.98 v1(48.03,71.98) ; 41.25,73.74 R45.2 ; 41.25,73.74 40.72,73.2 39.6,73.2 39.6,74.47
  Bottom Layer w0.254: v1(41.38,72.95) 41.38,72.47 41.86,71.98 v1(48.03,71.98)
ADDR0: length 11.5
  Top Layer w0.254: R37.1 v1(4.32,67.92) ; H1.2 R29.1
  Bottom Layer w0.254: v1(4.32,67.92) 4.32,66.95 4.78,66.5 6.86,66.5 7.52,65.84 H1.2
ADDR0_I: length 63.5
  Top Layer w0.254: R29.2 16.61,64.62 17.14,64.08 53.24,64.08 58.06,59.26 74.98,59.26 74.99,59.25
ADDR1: length 13.5
  Top Layer w0.254: H1.4 R30.1 ; R38.1 v1(6.86,67.92)
  Bottom Layer w0.254: v1(6.86,67.92) 6.86,67.44 8.89,65.4 8.89,62.46 8.51,62.08 H1.4
ADDR1_I: length 63.9
  Top Layer w0.254: R30.2 15.77,62.08 17.27,63.58 53.03,63.58 57.85,58.75 74.99,58.75 74.99,58.74
ADDR2: length 15.7
  Top Layer w0.254: H1.6 R31.1 ; R39.1 v1(9.4,67.92)
  Bottom Layer w0.254: v1(9.4,67.92) 9.4,59.92 9.02,59.54 H1.6
ADDR2_I: length 64.8
  Top Layer w0.254: R31.2 14.96,59.54 18.5,63.08 52.82,63.08 57.65,58.25 74.99,58.25 74.99,58.24
ADDR3: length 19.8
  Top Layer w0.254: R32.1 H1.8 ; R40.1 v1(11.94,67.92)
  Bottom Layer w0.254: v1(11.94,67.92) 11.12,67.11 10.41,67.11 9.98,66.67 9.98,57.78 9.2,57 H1.8
ADDR3_I: length 65.6
  Top Layer w0.254: 74.99,57.74 74.99,57.75 57.44,57.75 52.61,62.58 20.39,62.58 14.81,57 R32.2
ADDR4: length 24.6
  Top Layer w0.254: R41.1 v1(14.48,67.92) ; H1.10 R33.1
  Bottom Layer w0.254: v1(14.48,67.92) 14.48,67.84 13.21,66.57 11.3,66.57 10.64,65.91 10.64,55.12 9.98,54.46 H1.10
ADDR4_I: length 67.9
  Top Layer w0.254: 74.99,57.24 74.99,57.25 57.23,57.25 52.41,62.08 21.36,62.08 16.99,57.71 16.99,55.22 16.23,54.46 R33.2
ADDR5: length 29.7
  Top Layer w0.254: H1.12 R34.1 ; R42.1 v1(17.02,67.92)
  Bottom Layer w0.254: v1(17.02,67.92) 17.02,66.8 16.18,65.96 11.96,65.96 11.51,65.51 11.51,53.11 10.31,51.92 H1.12
ADDR5_I: length 69.7
  Top Layer w0.254: R34.2 16.56,51.92 17.7,53.06 17.7,57.16 22.12,61.58 52.2,61.58 57.03,56.75 74.99,56.75 74.99,56.74
ADDR6: length 34.6
  Top Layer w0.254: R43.1 v1(19.56,67.92) ; H1.14 R35.1
  Bottom Layer w0.254: H1.14 10.62,49.38 12.14,50.9 12.14,64.67 12.83,65.35 18.9,65.35 19.56,66.01 v1(19.56,67.92)
ADDR6_I: length 72.1
  Top Layer w0.254: 74.99,55.24 74.99,55.25 56.4,55.25 50.75,60.91 23.17,60.91 18.34,56.08 18.34,49.86 17.86,49.38 R35.2
ADDR7: length 38.9
  Top Layer w0.254: R44.1 v1(22.1,67.92) ; H1.16 R36.1
  Bottom Layer w0.254: v1(22.1,67.92) 22.1,66.12 20.83,64.85 13.59,64.85 12.75,64.01 12.75,48.87 10.72,46.84 H1.16
ADDR7_I: length 74.1
  Top Layer w0.254: R36.2 18.59,46.84 19.02,47.27 19.02,55.65 23.7,60.32 50.62,60.32 56.2,54.75 74.99,54.75 74.99,54.74
BD0: length 54.8
  Top Layer w0.254: U4.89 98.29,78.3 98.76,78.77 115.98,78.77 116.23,79.02 116.23,100.95 CN1.36
BD0_IN: length 60
  Top Layer w0.254: U4.34 93.29,38.56 95.3,36.55 97.71,36.55 99.42,34.85 99.42,20.83 105.26,14.99 120.07,14.99 123.75,11.3 123.75,5.05 CN2.8
BD1: length 51.8
  Top Layer w0.254: CN1.32 111.15,100.95 111.15,82.98 109.96,81.79 96.42,81.79 95.29,80.66 U4.95
BD1_IN: length 57.9
  Top Layer w0.254: CN2.12 118.75,4.97 118.75,11.51 117.17,13.08 103.81,13.08 89.05,27.84 89.05,34.87 89.48,35.31 89.48,36.5 90.29,37.3 U4.28
BD2: length 48.9
  Top Layer w0.254: U4.99 93.29,83.53 94.31,84.56 105.13,84.56 106.07,85.5 106.07,100.95 CN1.28
BD2_IN: length 54.3
  Top Layer w0.254: CN2.16 113.64,5 113.64,10.19 112.34,11.48 102.97,11.48 87.3,27.15 87.3,35.59 87.86,36.14 87.86,37.67 88.79,38.6 88.79,40.45
BD3: length 45.6
  Top Layer w0.254: CN1.24 100.99,100.95 100.99,88.04 99.77,86.82 93.07,86.82 90.29,84.04 U4.105
BD3_IN: length 49.7
  Top Layer w0.254: U4.20 86.29,37.11 85.6,36.42 85.6,26.54 102.29,9.85 106.88,9.85 108.59,8.15 108.59,4.97 CN2.20
BD4: length 42.4
  Top Layer w0.254: U4.109 88.29,85.57 91.59,88.87 94.96,88.87 95.91,89.82 95.91,100.95 CN1.20
BD4_IN: length 46.5
  Top Layer w0.254: 84.79,40.45 84.79,38.15 83.87,37.24 83.87,25.83 101.55,8.15 102.82,8.15 103.53,7.44 103.53,4.95 CN2.24
BD5: length 39.6
  Top Layer w0.254: U4.115 85.29,85.72 90.83,91.26 90.83,100.95 CN1.16
BD5_IN: length 43.9
  Top Layer w0.254: CN2.28 98.4,5 98.4,8.94 82.29,25.05 U4.12
BD6: length 38.3
  Top Layer w0.254: CN1.12 85.75,100.95 85.75,89.56 83.29,87.1 U4.119
BD6_IN: length 42.4
  Top Layer w0.254: CN2.32 93.32,5 93.32,11.35 80.79,23.89 U4.9
BD7: length 37.5
  Top Layer w0.254: U4.123 81.29,88.33 80.67,88.95 80.67,100.95 CN1.8
BD7_IN: length 41.2
  Top Layer w0.254: U4.5 78.79,23.12 88.24,13.66 88.24,5 CN2.36
CKA: length 184.4
  Top Layer w0.254: v1(126.39,93.27) 126.39,100.95 CN1.44 ; 79.35,3.73 78.03,5.05 v1(78.03,11.46) 78.03,13.31 70.61,20.73 v1(70.61,22.07) ; v1(70.89,26.31) 70.89,42.11 72.53,43.75 74.99,43.75
  Bottom Layer w0.254: v1(70.89,26.31) 70.61,26.03 v1(70.61,22.07) ; v1(78.03,11.46) 122.66,11.46 126.39,15.19 v1(126.39,93.27)
CN1_NC2: length 44.6
  Top Layer w0.254: CN1.27 104.75,86.51 103.4,85.17 94.03,85.17 92.79,83.92 92.79,65.55
CN1_NC3: length 41.7
  Top Layer w0.254: 89.79,65.55 89.79,84.38 92.68,87.27 98.61,87.27 99.67,88.33 CN1.23
CN1_NC4: length 38.4
  Top Layer w0.254: CN1.19 94.59,90.16 93.91,89.48 91.44,89.48 87.79,85.83 87.79,65.55
CN1_NC5: length 36.1
  Top Layer w0.254: 84.79,65.55 84.79,85.98 89.51,90.7 CN1.15
CN1_NC6: length 34.9
  Top Layer w0.254: 82.79,65.55 82.79,87.46 84.43,89.1 CN1.11
CN1_NC7: length 35.7
  Top Layer w0.254: U4.128 78.79,70.36 77.9,71.25 77.9,72.75 77.24,73.41 77.24,95.91 79.35,98.02 CN1.7
CN1_NC8: length 38.7
  Top Layer w0.254: U4.129 78.29,70.15 77.44,70.99 77.44,72.36 76.53,73.28 76.53,96.62 78.13,98.22 78.13,100.95 CN1.6
GD0: length 52.1
  Top Layer w0.254: 100.09,63.75 101.52,63.75 101.91,64.13 101.91,77.24 102.84,78.18 116.71,78.18 117.45,78.92 CN1.37
GD0_IN: length 56.7
  Top Layer w0.254: CN2.9 122.53,11.58 119.81,14.3 104.83,14.3 98.86,20.27 98.86,34.57 97.51,35.92 95.12,35.92 92.79,38.25 92.79,40.45
GD1: length 49.3
  Top Layer w0.254: 95.79,65.55 95.79,79.99 97,81.2 111.05,81.2 112.37,82.52 CN1.33
GD1_IN: length 54
  Top Layer w0.254: 89.79,40.45 89.79,37.77 88.95,36.93 88.95,35.66 88.49,35.2 88.49,27.51 103.43,12.57 115.9,12.57 117.45,11.02 CN2.13
GD2: length 46.5
  Top Layer w0.254: CN1.29 107.29,84.94 106.17,83.82 94.69,83.82 93.79,82.91 93.79,65.55
GD2_IN: length 49.9
  Top Layer w0.254: CN2.17 112.37,9.14 110.54,10.97 102.77,10.97 86.82,26.92 86.82,35.82 87.38,36.38 87.38,37.92 88.29,38.83 U4.24
GD3: length 43.5
  Top Layer w0.254: CN1.25 102.21,87.33 101.14,86.26 93.29,86.26 90.79,83.75 90.79,65.55
GD3_IN: length 46.2
  Top Layer w0.254: 85.79,40.45 85.79,37.5 85.04,36.75 85.04,26.36 102.06,9.35 106.27,9.35 107.29,8.33 CN2.21
GD4: length 40.1
  Top Layer w0.254: CN1.21 97.13,89.43 95.91,88.21 91.75,88.21 88.79,85.26 88.79,65.55
GD4_IN: length 42.4
  Top Layer w0.254: CN2.25 102.21,6.81 83.31,25.7 83.31,37.48 84.29,38.46 U4.16
GD5: length 36.4
  Top Layer w0.254: CN1.17 92.05,91.67 86.79,86.4 86.79,65.55
GD5_IN: length 40.5
  Top Layer w0.254: 81.79,40.45 81.79,24.74 97.13,9.4 CN2.29
GD6: length 35.5
  Top Layer w0.254: CN1.13 86.97,89.92 83.79,86.73 83.79,65.55
GD6_IN: length 39.1
  Top Layer w0.254: CN2.33 92.05,11.84 80.29,23.6 U4.8
GD7: length 34.2
  Top Layer w0.254: CN1.9 81.89,88.37 81.79,88.26 81.79,65.55
GD7_IN: length 37.8
  Top Layer w0.254: CN2.37 86.97,14.15 78.29,22.83 U4.4
I2C1_SCL: length 21.6
  Top Layer w0.254: 61.34,44.28 61.34,46.51 v1(61.44,46.61) 60.99,47.07 58.7,47.07 57.62,45.98 R47.1 ; 74.99,46.75 65.57,46.75 65.45,46.63 v1(64.18,46.63)
  Bottom Layer w0.254: v1(64.18,46.63) 64.16,46.61 v1(61.44,46.61)
I2C1_SDA: length 22.6
  Top Layer w0.254: 62.85,45.99 63.09,46.23 ; 62.85,45.99 63.16,45.99 ; 62.85,45.99 62.61,45.74 62.61,44.28 ; 63.09,46.23 63.34,45.99 ; 63.09,46.23 63.09,46.05 63.16,45.99 ; 63.09,46.23 61.42,47.9 58.47,47.9 57.76,48.61 R48.1 ; 63.34,45.99 63.16,45.99 ; 63.34,45.99 65.72,45.99 65.99,46.25 74.99,46.25
I2C2_SCL: length 42.7
  Top Layer w0.254: U5.21 140.2,45.38 137.07,42.25 100.09,42.25
I2C2_SDA: length 46.1
  Top Layer w0.254: v1(138.71,44.81) 136.65,42.75 100.09,42.75
  Bottom Layer w0.254: v1(138.71,44.81) 138.71,44.83 140.55,46.67 142.8,46.67 U5.20
IN: length 19
  Top Layer w1.8: D2.1 15.93,16.14 ; 15.93,16.14 15.93,10.24 U3.1 ; 15.93,16.14 15.93,19.76 17.73,21.56 17.73,25.17
JTCK: length 66.7
  Top Layer w0.254: 62.59,61.9 62.74,61.75 74.99,61.75 ; JTAG1.9 47.9,99.63 R27.1 ; v1(58.98,85.34) v1(58.98,91.97)
  Bottom Layer w0.254: v1(62.36,62.1) 61.44,63.02 61.44,64.72 58.98,67.18 v1(58.98,85.34) ; JTAG1.9 47.8,93.37 48.08,93.09 57.86,93.09 v1(58.98,91.97)
JTDI: length 72.1
  Top Layer w0.254: v1(57.53,85.42) v1(57.53,91.03) ; 74.99,61.25 62.22,61.25 59.46,64.01 v1(59.46,64.59) ; JTAG1.5 42.77,99.68 R24.1
  Bottom Layer w0.254: v1(57.53,91.03) 56.64,91.92 43,91.92 42.72,92.2 JTAG1.5 ; v1(57.53,85.42) 57.53,66.52 v1(59.46,64.59)
JTDO: length 73.1
  Top Layer w0.254: v1(63.7,50.75) 63.91,50.55 72.52,50.55 73.31,49.75 74.99,49.75 ; JTAG1.13 52.98,99.63 R26.1 ; v1(59.66,85.93) v1(59.66,92.46)
  Bottom Layer w0.254: v1(59.66,85.93) 59.66,67.36 62.1,64.92 62.1,63.68 62.97,62.81 62.97,51.49 v1(63.7,50.75) ; v1(59.66,92.46) 58.47,93.65 53.21,93.65 52.88,93.98 JTAG1.13
JTMS: length 77.4
  Top Layer w0.254: U4.124 80.79,63.01 v1(80.72,62.94) ; v1(60.25,64.44) 60.25,64.01 61.42,62.84 68.12,62.84 68.48,62.48 v1(69.01,62.48) ; v1(58.32,85.98) 58.32,91.47 v1(58.27,91.52) ; JTAG1.7 45.31,99.68 R25.1
  Bottom Layer w0.254: v1(58.32,85.98) 58.32,67.03 60.25,65.1 v1(60.25,64.44) ; v1(58.27,91.52) 57.23,92.56 45.72,92.56 45.26,93.02 JTAG1.7 ; v1(80.72,62.94) 80.26,62.48 v1(69.01,62.48)
JTRST: length 87.6
  Top Layer w0.254: v1(57.38,51.89) 59.16,51.89 61.06,49.99 72.42,49.99 73.15,49.25 74.99,49.25 ; R23.1 40.23,99.68 JTAG1.3 ; v1(56.74,86) v1(56.74,90.55)
  Bottom Layer w0.254: v1(57.38,51.89) 56.74,52.53 v1(56.74,86) ; v1(56.74,90.55) 55.96,91.34 40.44,91.34 40.18,91.59 JTAG1.3
LA: length 184
  Top Layer w0.254: CN1.42 123.85,100.95 v1(123.85,93.27) ; 74.99,45.75 70.01,45.75 69.6,45.34 69.6,24.7 80.57,13.73 v1(80.57,12.66) 80.57,5.05 81.89,3.73
  Bottom Layer w0.254: v1(123.85,93.27) 123.85,15.49 121.01,12.66 v1(80.57,12.66)
LB: length 174.2
  Top Layer w0.254: CN1.41 v1(122.53,93.27) ; 81.89,6.27 v1(81.89,13.31) 81.89,13.51 70.13,25.27 70.13,44.73 70.65,45.25 74.99,45.25
  Bottom Layer w0.254: v1(122.53,93.27) 122.53,15.49 120.35,13.31 v1(81.89,13.31)
LC: length 166.1
  Top Layer w0.254: U4.1 76.79,19.89 82.73,13.95 v1(83.11,13.95) 83.11,5.05 84.43,3.73 ; v1(121.31,93.27) 121.31,100.95 CN1.40
  Bottom Layer w0.254: v1(83.11,13.95) 119.46,13.95 121.31,15.8 v1(121.31,93.27)
LCP1: length 15.6
  Top Layer w0.381: 32.92,79.88 31.73,79.88 31.19,80.42 31.19,84.4 30.18,85.42 24.84,85.42 23.7,86.56 U6.6
LCP2: length 8.6
  Top Layer w0.381: RJ2.7 19.89,90.7 20.57,90.02 21.67,90.02 22.43,89.26 U6.7
LCP_IN: length 18.4
  Top Layer w0.381: 20.75,80.87 21.56,80.87 ; 20.75,80.87 21.16,80.47 ; 20.75,80.87 16.13,80.87 15.39,80.14 15.39,78.92 15.01,78.54 RJ1.7 ; 21.56,80.87 21.16,80.47 ; 21.56,80.87 21.82,80.87 22.43,80.26 U6.14 ; 21.16,80.47 U6.13
LCPII: length 53.9
  Top Layer w0.254: 76.87,71.97 76.87,70.83 77.79,69.91 U4.130
  Top Layer w0.381: U7.2 34.19,77.88 34.87,77.19 48.51,77.19 50.67,75.03 73.81,75.03 76.87,71.97
LD: length 157
  Top Layer w0.254: 84.43,6.27 v1(84.43,14.63) 83.95,14.63 77.29,21.29 U4.2 ; CN1.39 v1(119.99,93.27)
  Bottom Layer w0.254: v1(119.99,93.27) 119.99,16.5 118.12,14.63 v1(84.43,14.63)
LED: length 48.1
  Top Layer w0.254: 47.27,30.28 47.27,48.67 49.71,51.1 58.8,51.1 60.4,49.5 71.55,49.5 72.31,48.75 74.99,48.75
OE_PWM2: length 7
  Top Layer w0.381: U6.5 RJ2.3
OE_PWM_B: length 65.6
  Top Layer w0.254: v1(117.73,59.26) 116.72,58.25 100.09,58.25 ; v1(109.83,93.25) CN1.31
  Bottom Layer w0.254: v1(109.83,93.25) 109.83,92.18 111.07,90.93 116.54,90.93 118.47,89 118.47,59.99 v1(117.73,59.26)
OE_PWM_G: length 63.1
  Top Layer w0.254: 100.09,57.75 117.75,57.75 v1(118.41,58.42) ; v1(114.91,93.25) CN1.35
  Bottom Layer w0.254: v1(114.91,93.25) 115.85,92.3 117.78,92.3 119.18,90.91 119.18,59.18 v1(118.41,58.42)
OE_PWM_IN: length 23.5
  Top Layer w0.381: 23.7,82.29 23.34,82.65 ; 23.7,82.29 24.06,82.65 ; 23.7,82.29 U6.15 ; 23.7,82.29 23.7,82.65 ; 23.34,82.65 16.94,82.65 15.98,83.62 RJ1.3 ; 23.34,82.65 23.7,82.65 ; 24.06,82.65 23.7,82.65 ; 24.06,82.65 24.51,82.65 24.97,82.19 U6.16
OE_PWM_R: length 69.6
  Top Layer w0.254: CN1.45 v1(127.61,93.22) ; v1(127.61,58.37) 125.99,56.75 100.09,56.75
  Bottom Layer w0.254: v1(127.61,58.37) v1(127.61,93.22)
PA0: length 51.9
  Top Layer w0.254: v1(138.71,37.19) 97,37.19 96.29,37.9 U4.40
  Bottom Layer w0.254: U5.26 142.77,39.03 140.5,39.03 138.71,37.24 v1(138.71,37.19)
PA1: length 48.2
  Top Layer w0.254: U5.25 140.23,39.03 138.98,39.03 137.64,37.69 97.36,37.69 96.79,38.27 96.79,40.45
PA2: length 50.8
  Top Layer w0.254: U4.42 97.29,38.5 97.61,38.18 137.16,38.18 v1(138.71,39.73)
  Bottom Layer w0.254: U5.24 142.77,41.57 140.55,41.57 v1(138.71,39.73)
PA3: length 43.4
  Top Layer w0.254: U5.19 140.23,46.65 139.36,46.65 135.96,43.25 100.09,43.25
PA4: length 46.3
  Top Layer w0.254: 100.09,44.75 136.11,44.75 v1(138.71,47.35)
  Bottom Layer w0.254: U5.18 142.77,49.19 140.55,49.19 v1(138.71,47.35)
PA5: length 43.6
  Top Layer w0.254: 100.09,45.25 135.37,45.25 139.31,49.19 140.23,49.19 U5.17
PA6: length 47
  Top Layer w0.254: 100.09,45.75 134.57,45.75 v1(138.71,49.89)
  Bottom Layer w0.254: U5.16 142.77,51.73 140.55,51.73 v1(138.71,49.89)
PA7: length 44.2
  Top Layer w0.254: 100.09,46.25 133.4,46.25 138.89,51.74 139.52,51.74 140.78,53 U5.15
PB0: length 48.2
  Top Layer w0.254: v1(138.71,54.97) 131.49,47.75 100.09,47.75
  Bottom Layer w0.254: v1(138.71,54.97) 140.55,56.81 142.77,56.81 U5.12
PB1: length 45.5
  Top Layer w0.254: 100.09,48.25 130.83,48.25 139.39,56.81 139.74,56.81 141.01,58.08 U5.11
PB2: length 49
  Top Layer w0.254: 100.09,48.75 130.23,48.75 138.71,57.23 v1(138.71,57.51)
  Bottom Layer w0.254: v1(138.71,57.51) 138.74,57.51 140.58,59.35 142.77,59.35 U5.10
PC4: length 47.6
  Top Layer w0.254: v1(138.71,52.43) 133.03,46.75 100.09,46.75
  Bottom Layer w0.254: U5.14 142.77,54.27 140.55,54.27 v1(138.71,52.43)
PC5: length 44.9
  Top Layer w0.254: 100.09,47.25 132.21,47.25 139.23,54.27 140.23,54.27 U5.13
PF11: length 46.9
  Top Layer w0.254: U5.9 140.23,59.35 138.82,59.35 133.91,54.44 133.91,53.16 130,49.25 100.09,49.25
PF12: length 50.3
  Top Layer w0.254: 138.71,59.94 v1(138.71,60.05) 132.92,54.25 132.92,53.06 129.61,49.75 100.09,49.75
  Bottom Layer w0.254: U5.8 142.77,61.89 140.55,61.89 v1(138.71,60.05)
PF13: length 47.2
  Top Layer w0.254: 100.09,51.25 130.09,51.25 131.88,53.03 131.88,54.56 139.21,61.89 140.23,61.89 U5.7
PF14: length 50.2
  Top Layer w0.254: v1(138.71,62.59) 131.32,55.19 131.32,54.36 128.71,51.75 100.09,51.75
  Bottom Layer w0.254: v1(138.71,62.59) 140.55,64.43 142.77,64.43 U5.6
PF15: length 47.4
  Top Layer w0.254: 100.09,52.25 127.87,52.25 130.3,54.69 130.3,55.37 139.36,64.43 140.23,64.43 U5.5
PH2: length 47.1
  Top Layer w0.254: 97.79,40.45 97.79,38.94 98.09,38.63 136.35,38.63 140.55,42.84 U5.23
PH3: length 49.4
  Top Layer w0.254: v1(138.71,42.27) 138.71,42.24 135.64,39.17 98.68,39.17 98.29,39.56 U4.44
  Bottom Layer w0.254: v1(138.71,42.27) 140.55,44.11 142.77,44.11 U5.22
RD0: length 56.5
  Top Layer w0.254: 100.09,63.25 101.91,63.25 102.57,63.91 102.57,76.89 103.25,77.57 117.09,77.57 118.77,79.25 118.77,100.95 CN1.38
RD0_IN: length 59.4
  Top Layer w0.254: U4.32 92.29,37.51 93.02,36.78 93.37,36.78 94.82,35.33 97.33,35.33 98.25,34.42 98.25,19.86 104.34,13.77 118.82,13.77 121.21,11.38 121.21,5.05 CN2.10
RD1: length 53.2
  Top Layer w0.254: CN1.34 113.69,100.95 113.69,81.64 112.4,80.34 97.59,80.34 96.29,79.04 U4.93
RD1_IN: length 56.3
  Top Layer w0.254: U4.26 89.29,37.93 88.44,37.08 88.44,35.99 87.86,35.41 87.86,27.38 103.2,12.04 114.73,12.04 116.23,10.54 116.23,4.95 CN2.14
RD2: length 50.3
  Top Layer w0.254: CN1.30 108.61,100.95 108.61,84.35 107.42,83.16 95.33,83.16 94.29,82.12 U4.97
RD2_IN: length 51.4
  Top Layer w0.254: CN2.18 111.1,5 111.1,7.92 108.53,10.49 102.44,10.49 86.21,26.72 86.21,36.17 86.79,36.75 86.79,40.45
RD3: length 46.9
  Top Layer w0.254: CN1.26 103.53,100.95 103.53,86.97 102.31,85.75 93.75,85.75 92.29,84.29 U4.101
RD3_IN: length 48.1
  Top Layer w0.254: U4.18 85.29,37.81 84.4,36.93 84.4,26.11 101.75,8.76 104.37,8.76 106.02,7.11 106.02,5 CN2.22
RD4: length 44
  Top Layer w0.254: CN1.22 98.45,100.95 98.45,89 97.21,87.76 92.13,87.76 89.29,84.92 U4.107
RD4_IN: length 44.8
  Top Layer w0.254: 82.79,40.45 82.79,25.34 100.97,7.16 100.97,4.97 CN2.26
RD5: length 40.4
  Top Layer w0.254: CN1.18 93.37,100.95 93.37,91.16 92.38,90.17 91.34,90.17 87.29,86.12 U4.111
RD5_IN: length 43.3
  Top Layer w0.254: U4.10 81.29,24.33 95.86,9.75 95.86,5 CN2.30
RD6: length 38.9
  Top Layer w0.254: CN1.14 88.29,100.95 88.29,90.3 84.29,86.29 U4.117
RD6_IN: length 41.8
  Top Layer w0.254: CN2.34 90.81,4.97 90.81,12.17 79.79,23.19 U4.7
RD7: length 37.7
  Top Layer w0.254: CN1.10 83.21,100.95 83.21,88.7 82.29,87.77 U4.121
RD7_IN: length 40.5
  Top Layer w0.254: CN2.38 85.7,5 85.7,14.45 77.79,22.37 U4.3
RESET: length 206.7
  Top Layer w0.254: v1(91.26,44.88) 91.79,44.36 91.79,40.45 ; v1(60.38,85.32) v1(60.38,93.02) 59.87,93.52 58.45,93.52 57.88,92.95 R49.2 ; v1(68.05,47.45) 65.15,47.45 v1(65,47.29) ; v1(60.38,71.78) 66.95,71.78 68.99,69.75 U9.7 ; R3.2 C8.1 50.51,4.72 KEY2.1 ; v1(49.12,16.13) 49.33,16.33 v1(49.33,19.76) ; D3.2 37.71,91.94 v1(38.02,92.25)
  Bottom Layer w0.254: v1(91.26,44.88) 72.49,44.88 71.68,45.69 69.42,45.69 68.05,47.07 v1(68.05,47.45) ; v1(60.38,85.32) v1(60.38,71.78) 60.38,67.82 62.79,65.4 62.79,64.03 63.68,63.14 63.68,58.19 63.65,58.17 63.65,52.12 64.39,51.38 64.39,50.62 65,50.01 v1(65,47.29) 65,20.7 64.06,19.76 v1(49.33,19.76) ; JTAG1.15 55.42,94.77 55.98,94.21 59.18,94.21 v1(60.38,93.02) 60.38,91.97 58.22,89.81 40.82,89.81 38.38,92.25 v1(38.02,92.25) ; v1(49.12,16.13) 49.12,11.33 50.52,9.93 50.52,4.71 KEY2.1
SLAVE_RST1: length 6.7
  Top Layer w0.381: D3.1 29.69,90.3 28.78,89.38 U6.2
SLAVE_RST2: length 7
  Top Layer w0.381: RJ2.1 U6.3
SLAVE_RST_IN: length 34.3
  Top Layer w0.381: R28.2 27.2,75.31 27.51,75.62 U6.18 27.51,83.87 27.05,84.33 26.57,84.33 ; 26.19,84.33 26.24,84.28 26.24,83.94 ; 26.19,84.33 25.85,84.33 ; 26.19,84.33 26.57,84.33 ; 25.85,84.33 17.98,84.33 16.13,86.18 11.2,86.18 11.18,86.16 ; 25.85,84.33 26.24,83.94 ; 26.24,83.94 U6.17 ; 26.24,83.94 26.57,84.27 26.57,84.33
SPI2_CS: length 17.7
  Top Layer w0.254: v1(74.75,70.61) 75.84,70.61 77.29,69.17 U4.131 ; v1(66.27,70.92) 66.17,71.02 U9.1
  Bottom Layer w0.254: v1(74.75,70.61) 66.57,70.61 v1(66.27,70.92) 66.22,70.97
SPI2_MISO: length 15.7
  Top Layer w0.254: v1(72.39,64.03) 72.67,63.75 74.99,63.75 ; v1(66.07,69.67) 65.99,69.75 U9.2
  Bottom Layer w0.254: v1(72.39,64.03) 67.77,64.03 66.27,65.53 66.27,69.47 v1(66.07,69.67)
SPI2_MOSI: length 15.3
  Top Layer w0.254: 74.99,63.25 71.85,63.25 71.09,64.01 71.09,64.8 arc(71.21,65.08) 71.49,65.2 74.99,65.2 arc(75.39,65.6) 74.99,66 71.49,66 arc(71.21,66.12) 71.09,66.4 U9.5
SPI2_SCK: length 15.3
  Top Layer w0.254: U9.6 72.48,68.48 arc(72.76,68.6) 72.88,68.88 72.88,69.48 arc(73.28,69.88) 73.68,69.48 73.68,67.48 arc(74.08,67.08) 74.48,67.48 74.48,69.48 arc(74.88,69.88) 75.28,69.48 75.28,68.88 arc(75.4,68.6) 75.68,68.48 76.28,68.48 76.79,67.97 U4.132
STB: length 174.3
  Top Layer w0.254: 74.99,43.25 72.79,43.25 71.53,41.99 v1(71.53,25.35) ; 79.35,6.27 v1(79.35,12.05) 79.35,13.23 71.53,21.06 v1(71.53,21.67) ; CN1.43 v1(125.07,93.27)
  Bottom Layer w0.254: v1(71.53,21.67) v1(71.53,25.35) ; v1(125.07,93.27) 125.07,15.54 121.58,12.05 v1(79.35,12.05)
UART6_RX: length 44.9
  Top Layer w0.254: 74.99,54.25 54.74,54.25 54.23,54.76 H2.1
UART6_TX: length 45.3
  Top Layer w0.254: H2.2 55.26,52.22 55.77,52.73 59.23,52.73 59.69,52.27 72.95,52.27 73.47,51.75 74.99,51.75
USART3_RX: length 41.5
  Top Layer w0.254: 74.99,60.25 61.92,60.25 48.64,73.53 47.4,73.53 45.8,71.93 39.6,71.93
USART3_TX: length 41.6
  Top Layer w0.254: 39.6,75.74 39.65,75.79 45.57,75.79 47.42,73.94 48.81,73.94 62,60.75 74.99,60.75
USER_KEY1: length 92.1
  Top Layer w0.254: R2.2 C7.1 61.53,4.5 KEY1.1 ; v1(57.73,16) 57.73,19.89 53.49,24.13 50.9,24.13 49.89,25.15 49.89,49.33 51.11,50.55 58.47,50.55 60.15,48.87 71.32,48.87 71.94,48.25 74.99,48.25
  Bottom Layer w0.254: v1(57.73,16) 61.52,12.22 61.52,4.52 KEY1.1
$1N7882: length 0.4
  Top Layer w0.254: 109.48,6.27 109.83,6.27
$1N10347: length 35.9
  Top Layer w1.143: 32,20.43 32,25.71 25.78,31.93 U1.2
  Top Layer w1.8: D1.1 31.13,19.56 32,20.43 35.8,20.43 37.08,21.72
$1N11268: length 9.2
  Top Layer w0.254: 109.17,60.44 108.98,60.25 100.09,60.25
$1N11269: length 6.2
  Top Layer w0.254: U4.125 80.29,68.46 79.68,69.06 C14.2
$1N14867: length 3.3
  Top Layer w0.762: 4.01,18.41 7.31,18.41
$1N19356: length 13.7
  Top Layer w0.254: 90.79,40.45 90.79,38.86 91.29,38.35 91.29,35.71 93.02,33.98 93.02,33.25 92.63,32.87 91.44,32.87 91.87,32.43 91.87,29.22
$1N19357: length 14.2
  Top Layer w0.254: 96.52,29.25 96.32,29.45 96.32,32.87 94.95,32.87 91.69,36.12 91.69,38.63 91.29,39.04 U4.30
$1N25346: length 2.3
  Top Layer w0.254: 47.24,28.16 47.35,28.06 R50.1

## Copper pours and planes (outline as drawn; the poured copper is in the pictures)
+3.3V on Bottom Layer: 32.61,11.91 33.68,11.91 34.8,13.03 34.8,13.51 34.32,14 34.32,14.02 32.94,14.02 32.46,13.54 32.46,12.06
GND on Top Layer: -31.9,118.54 162.94,118.54 175.92,105.56 175.92,-0.18 157.63,-18.47 -28.55,-18.47 -37.21,-9.8 -37.21,113.23
GND on Bottom Layer: 4.98,28.6 7.59,28.6 9.35,26.85 9.35,23.11 11.58,20.88 21.49,20.88 24.49,17.88 24.49,15.55 22.22,13.28 8.03,13.28 2.46,18.85 2.46,26.09
GND on Bottom Layer: -11.02,119.99 144.63,119.99 164.06,100.56 164.06,3.02 152.68,-8.36 -17.47,-8.36 -19.05,-6.78 -19.05,111.96

Small or netless copper shapes (teardrops, artwork), in the pictures only: 582 on Top Layer, 162 on Bottom Layer

## Text on the board
Document Layer: 螺丝孔直径4.5mm
Top Silkscreen Layer: NC | S1 | S7 | + | - | <- | 复位 | 功能
